# EAGLE design pneu-io (EAGLE 7.6.0)
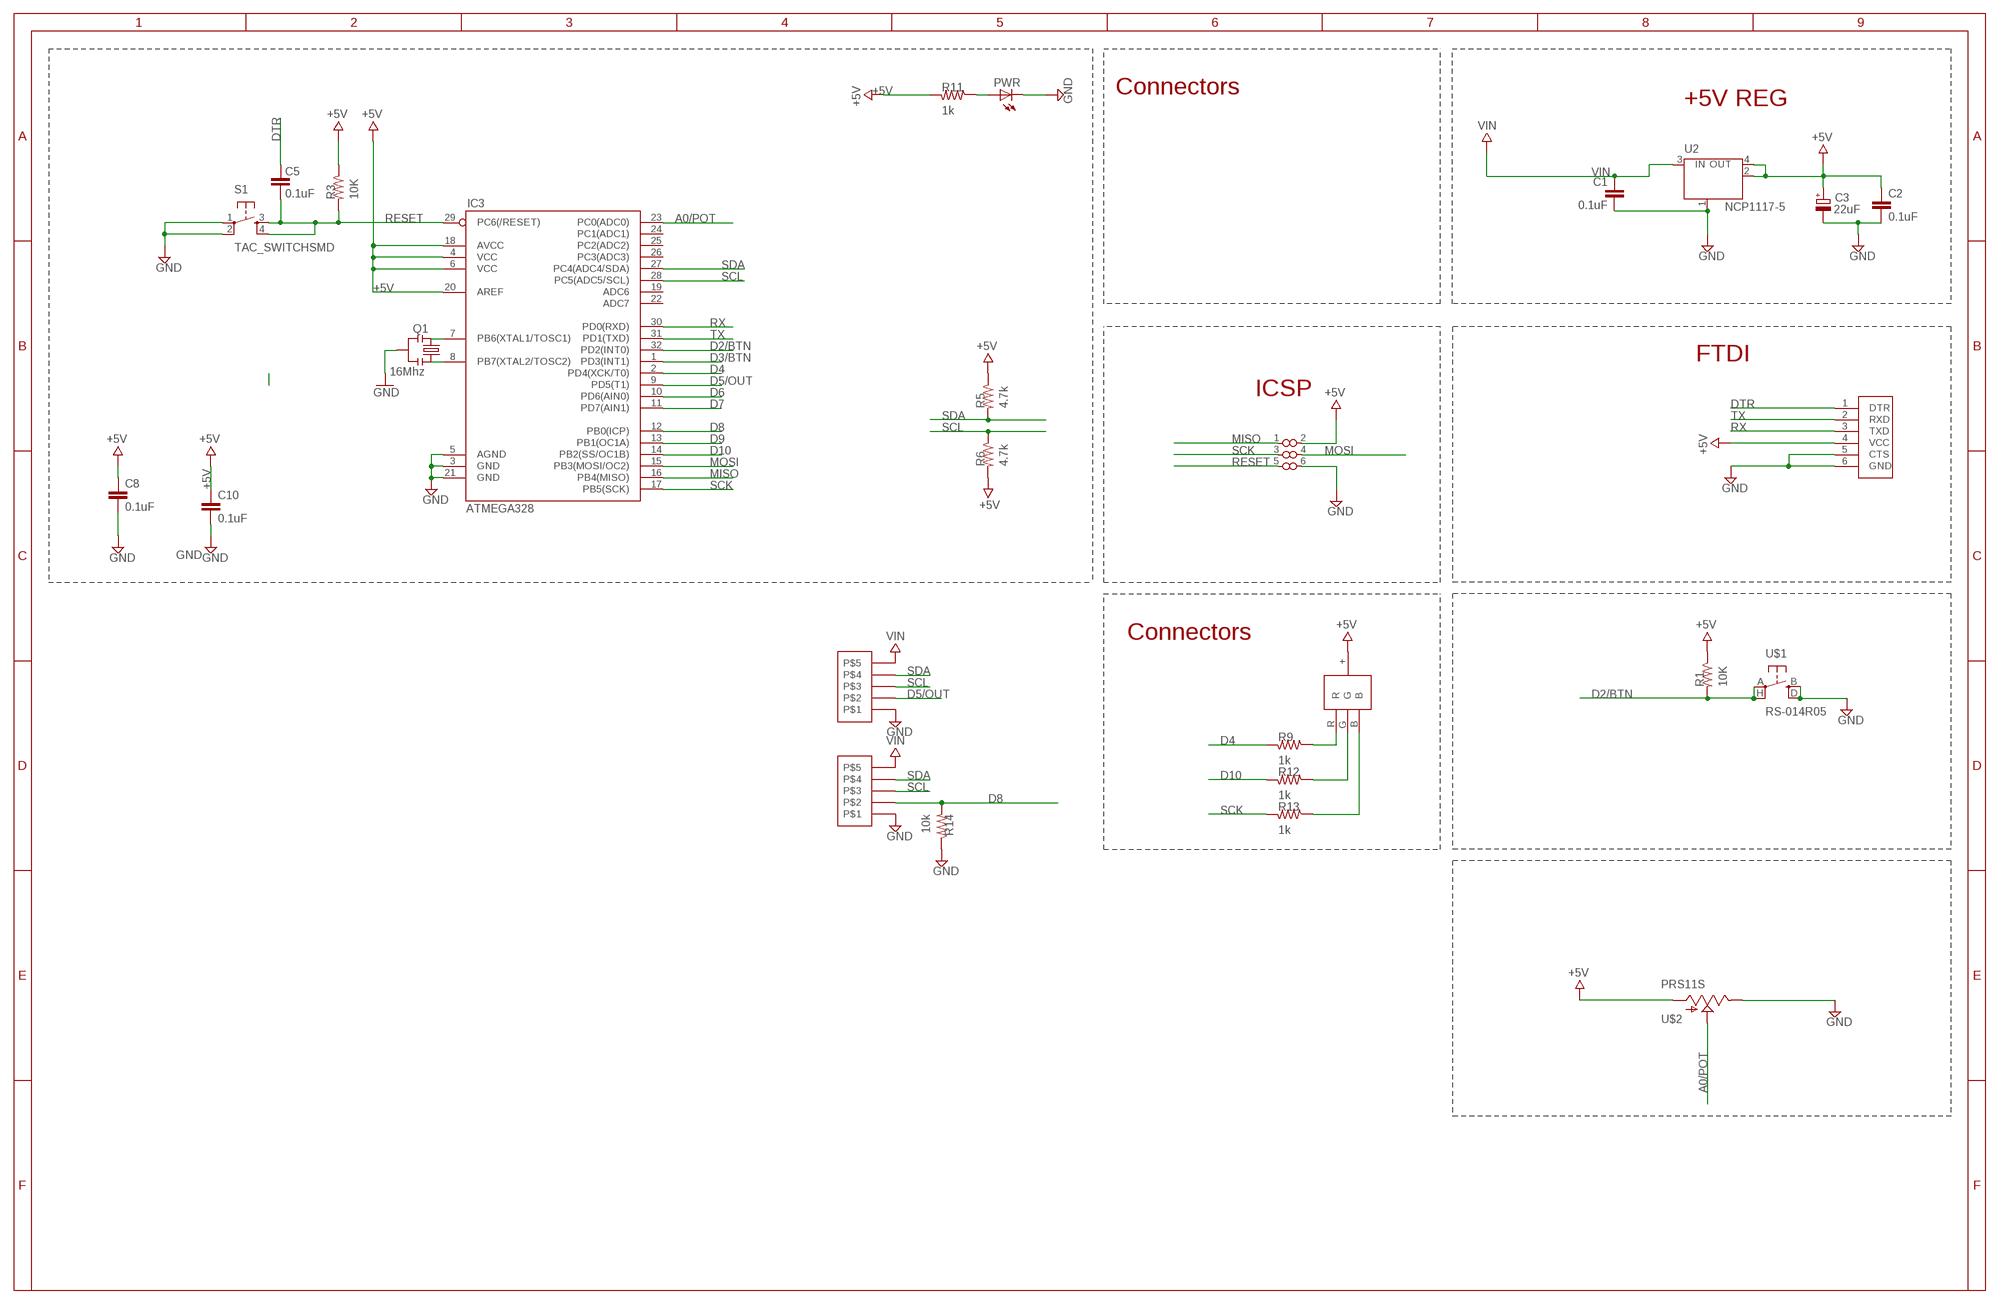
[diagram p0: schematic, sheet 1]

## Parts
C1  0.1uF  CAP0603-CAP  [0603-CAP]
C2  0.1uF  CAP0603-CAP  [0603-CAP]
C3  22uF  CPOL-EUSMCB  [SMC_B]
C5  0.1uF  CAP0603-CAP  [0603-CAP]
C8  0.1uF  CAP0603-CAP  [0603-CAP]
C10  0.1uF  CAP0603-CAP  [0603-CAP]
IC3  ATMEGA328  ATMEGA168  [TQFP32-08]
PWR  LEDCHIPLED_0603  [CHIPLED_0603]
Q1  16Mhz  RESONATORSMD  [RESONATOR-SMD]
R1  10K  RESISTOR0805-RES  [0805]
R3  10K  RESISTOR0805-RES  [0805]
R5  4.7k  RESISTOR0805-RES  [0805]
R6  4.7k  RESISTOR0805-RES  [0805]
R9  1k  RESISTOR0805-RES  [0805]
R11  1k  RESISTOR0805-RES  [0805]
R12  1k  RESISTOR0805-RES  [0805]
R13  1k  RESISTOR0805-RES  [0805]
R14  10k  RESISTOR0805-RES  [0805]
S1  TAC_SWITCHSMD  [TACTILE-SWITCH-SMD]
U2  NCP1117-5  LINEAR_MC33269ST  [LINEAR_SOT223]
U$1  RS-014R05  [SWITCH-11MM]
U$2  PRS11S  [PRS11S]
U$10  ISP_POGO  [POGO_ISP]
U$12  FTDI_POGO  [FTDI_POGO]
U$21  LTST-C19FD1WT  [LTST]
U$24  1X05  [1X05_TIGHT]
U$27  1X05  [1X05_TIGHT]

## Nets
+5V: C2.1 C3.+ C8.1 C10.1 IC3.4(VCC) IC3.6(VCC) IC3.18(AVCC) IC3.20(AREF) R1.1 R3.1 R5.1 R6.2 R11.2 U2.2(OUT) U2.4(OUT) U$2.1(A) U$10.2(VCC) U$12.4(VCC) U$21.+(VCC)
A0/POT: IC3.23(PC0(ADC0)) U$2.2(S)
D2/BTN: IC3.32(PD2(INT0)) R1.2 U$1.A U$1.H
D3/BTN: IC3.1(PD3(INT1))
D4: IC3.2(PD4(XCK/T0)) R9.2
D5/OUT: IC3.9(PD5(T1)) U$27.P$4
D6: IC3.10(PD6(AIN0))
D7: IC3.11(PD7(AIN1))
D8: IC3.12(PB0(ICP)) R14.2 U$24.P$4
D9: IC3.13(PB1(OC1A))
D10: IC3.14(PB2(SS/OC1B)) R12.2
DTR: C5.2 U$12.1(DTR)
GND: C1.2 C2.2 C3.- C8.2 C10.2 IC3.3(GND) IC3.5(AGND) IC3.21(GND) PWR.C Q1.2 R14.1 S1.1 S1.2 U2.1(GND/ADJ) U$1.B U$1.D U$2.3(E) U$10.6(GND) U$12.5(CTS) U$12.6(GND) U$24.P$5 U$27.P$5
MISO: IC3.16(PB4(MISO)) U$10.1(MISO)
MOSI: IC3.15(PB3(MOSI/OC2)) U$10.4(MOSI)
N$4: IC3.8(PB7(XTAL2/TOSC2)) Q1.1
N$8: IC3.7(PB6(XTAL1/TOSC1)) Q1.3
N$10: PWR.A R11.1
N$11: R9.1 U$21.R
N$12: R12.1 U$21.G
N$13: R13.1 U$21.B
RESET: C5.1 IC3.29(PC6(/RESET)) R3.2 S1.3 S1.4 U$10.5(RESET)
RX: IC3.30(PD0(RXD)) U$12.3(TXD)
SCK: IC3.17(PB5(SCK)) R13.2 U$10.3(SCK)
SCL: IC3.28(PC5(ADC5/SCL)) R6.1 U$24.P$3 U$27.P$3
SDA: IC3.27(PC4(ADC4/SDA)) R5.2 U$24.P$2 U$27.P$2
TX: IC3.31(PD1(TXD)) U$12.2(RXD)
VIN: C1.1 U2.3(IN) U$24.P$1 U$27.P$1
Unconnected: IC3.19(ADC6) IC3.22(ADC7) IC3.24(PC1(ADC1)) IC3.25(PC2(ADC2)) IC3.26(PC3(ADC3))

## Notes on the sheet
- Connectors
- +5V REG
- FTDI
- ICSP
- Connectors

## Library data of the parts
C1 C2 C5 C8 C10 = SparkFun-Capacitors:CAP: Capacitor Standard 0603 ceramic capacitor, and 0.1" leaded capacitor.
C3 = rcl:CPOL-EU: POLARIZED CAPACITOR, European symbol
IC3 = SparkFun:ATMEGA168
PWR = adafruit:LED: LED OSRAM: - CHIPLED LG R971, LG N971, LY N971, LG Q971, LY Q971, LO R971, LY R971 LH N974, LH R974 LS Q976, LO Q976, LY Q976 LO Q996 - Hyper CHIPLED LW Q18S LB Q993, LB Q99A, LB R99A - SideLED LS A670, LO A670, LY A670, LG A670, LP A670 LB A673, LV A673, LT A673, LW A673 LH A674 LY A675 LS A676, LA A676, LO A676, LY A676, LW A676 LS A679, LY A679, LG A679 - Hyper Micro SIDELED® LS Y876, LA Y876, LO Y876, LY Y876 LT Y87S - SmartLED LW L88C, LW L88S LB L89C, LB L89S, LG L890 LS L89K, LO L89K, LY L89K LS L896, LA L896, LO L896, LY L896 - TOPLED LS T670, LO T670, LY T670, LG T670, LP T670 LSG T670, LSP T670, LSY T670, LOP T670, LYG T670 LG T671, LOG T671, LSG T671 LB T673, LV T673, LT T673, LW T673 LH T674 LS T676, LA T676, LO T676, LY T676, LB T676, LH T676, LSB T676, LW T676 LB T67C, LV T67C, LT T67C, LS T67K, LO T67K, LY T67K, LW E67C LS E67B, LA E67B, LO E67B, LY E67B, LB E67C, LV E67C, LT E67C LW T67C LS T679, LY T679, LG T679 LS T770, LO T770, LY T770, LG T770, LP T770 LB T773, LV T773, LT T773, LW T773 LH T774 LS E675, LA E675, LY E675, LS T675 LS T776, LA T776, LO T776, LY T776, LB T776 LHGB T686 LT T68C, LB T68C - Hyper Mini TOPLED® LB M676 - Mini TOPLED Santana® LG M470 LS M47K, LO M47K, LY M47K Source: http://www.osram.convergy.de/
Q1 = SparkFun:RESONATOR: Resonator Small SMD resonator. This is the itty bitty 10/20MHz resonators with built in caps. CSTCE10M0G55 and CSTCE20M0V53. Footprint has been reviewed closely but hasn't been tested yet.
R1 R3 R5 R6 R9 R11-R14 = SparkFun-Resistors:RESISTOR: Resistor Basic schematic elements and footprints for 0603, 1206, and PTH resistors.
S1 = SparkFun-Electromechanical:TAC_SWITCH: Momentary Switch Button commonly used for reset or general input. Spark Fun Electronics SKU : COM-00097 SMT- SWCH-08247; PROD_ID: SWCH-08247
U2 = SmartPrj:LINEAR_MC33269ST*: Adjustable Output Low Dropout Voltage Regulator 800 mA Source: http://www.onsemi.com/pub/Collateral/MC33269-D.PDF
U$1 = digikey:RS-014R05
U$2 = digikey:PRS11S
U$10 = digikey:ISP_POGO
U$12 = digikey:FTDI_POGO
U$21 = digikey:LTST-C19FD1WT
U$24 U$27 = digikey:1X05

## Net classes
1 vcc: width 0.254 mm

## Board
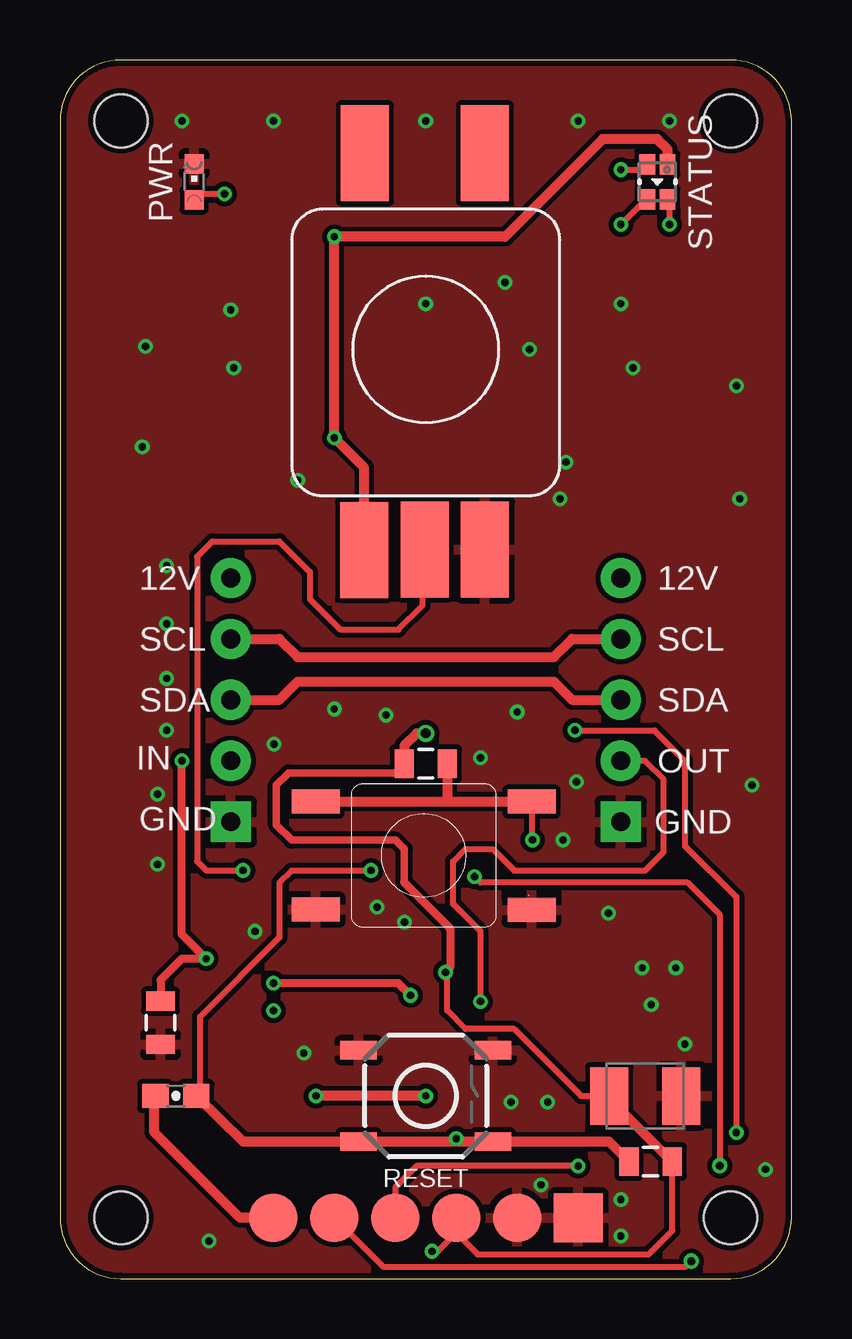
[diagram p1: board, top side]
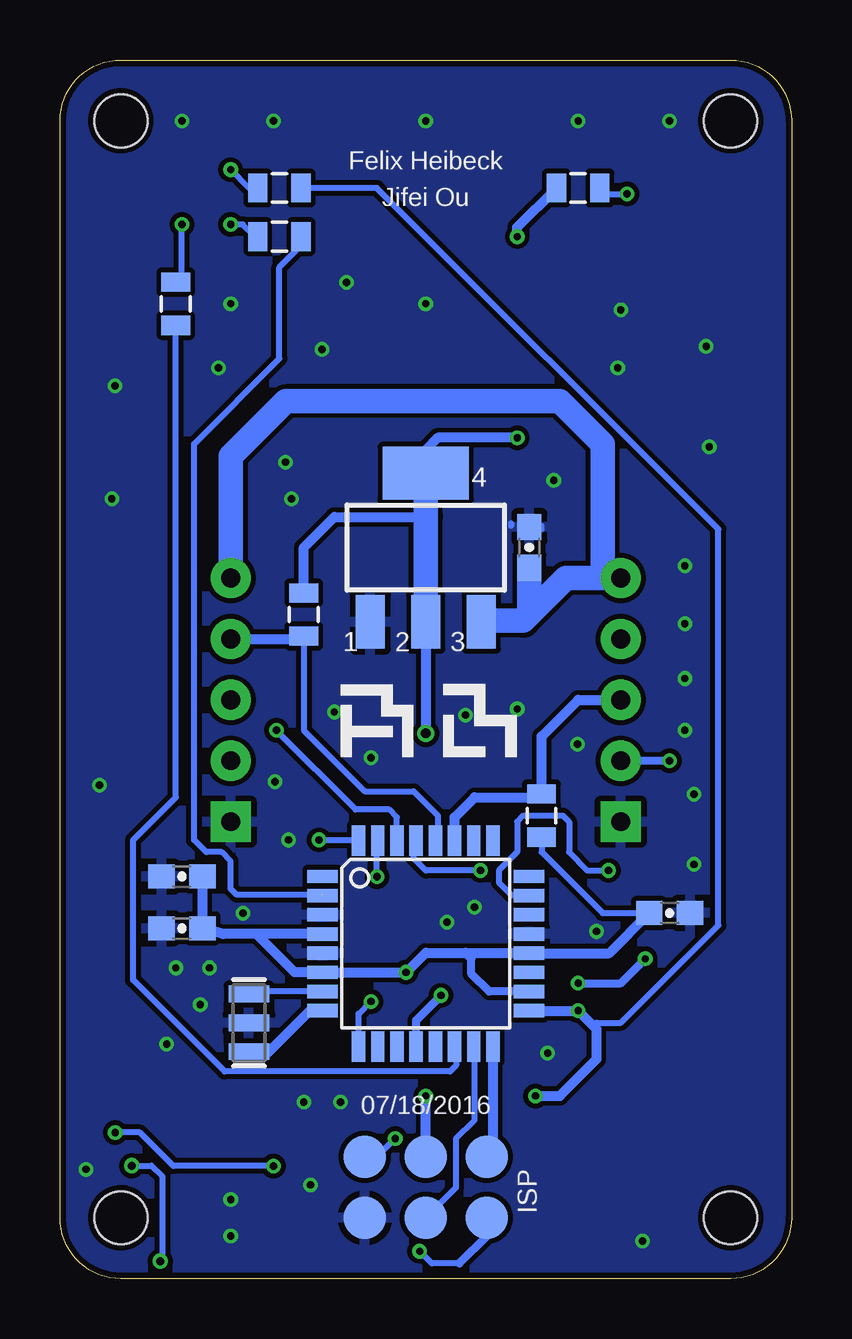
[diagram p2: board, bottom side, seen from below]

Size 30.48 x 50.8 mm. Coordinates in mm from the lower left corner, seen from the top.
Outline: 2.54,0 27.94,0 arc90 30.48,2.54 30.48,48.26 arc90 27.94,50.8 2.54,50.8 arc90 0,48.26 0,2.54 arc90 2.54,0
Copper layers (1*16): Top 0.035mm / dielectric 1.5mm / Bottom 0.035mm
Design rules "autoroute-10mil *": minimum track width 10mil, minimum drill 12mil, track to track 8mil, track to pad 8mil, pad to pad 8mil, via to via 8mil, smd to smd 0mil, copper to edge 10mil, drill to drill 10mil, minimum pad ring 10mil, minimum via ring 6mil, stop-mask expansion 2mil, vias tented up to drill 16mil, thermal gap 10mil
Holes 2.2 mm at 2.54,48.26 27.94,48.26 27.94,2.54 2.54,2.54

### Footprints (pad centres in the part's own frame; a part is rotated, then mirrored left to right if it is on the bottom)
0603-CAP = smd 1.1 x 1: 1 -0.85,0; 2 0.85,0
SMC_B = smd 1.6 x 2.4: + -1.5,0; - 1.5,0
TQFP32-08 = smd 1.27 x 0.559: 1 -4.293,2.8; 2 -4.293,2; 3 -4.293,1.2; 4 -4.293,0.4; 5 -4.293,-0.4; 6 -4.293,-1.2; 7 -4.293,-2; 8 -4.293,-2.8; 17 4.293,-2.8; 18 4.293,-2; 19 4.293,-1.2; 20 4.293,-0.4; 21 4.293,0.4; 22 4.293,1.2; 23 4.293,2; 24 4.293,2.8 | smd 0.559 x 1.27: 9 -2.8,-4.293; 10 -2,-4.293; 11 -1.2,-4.293; 12 -0.4,-4.293; 13 0.4,-4.293; 14 1.2,-4.293; 15 2,-4.293; 16 2.8,-4.293; 25 2.8,4.293; 26 2,4.293; 27 1.2,4.293; 28 0.4,4.293; 29 -0.4,4.293; 30 -1.2,4.293; 31 -2,4.293; 32 -2.8,4.293
CHIPLED_0603 = smd 0.8 x 0.8: A 0,-0.75; C 0,0.75
RESONATOR-SMD = smd 0.7 x 1.7: 1 -1.2,0; 2 0,0; 3 1.2,0
0805 = smd 0.8 x 1.2: 1 -0.9,0; 2 0.9,0
TACTILE-SWITCH-SMD = smd 1.524 x 0.762: 1 -2.794,1.905; 2 2.794,1.905; 3 -2.794,-1.905; 4 2.794,-1.905
LINEAR_SOT223 = smd 1.219 x 2.235: 1 -2.311,-3.099; 2 0,-3.099; 3 2.311,-3.099 | smd 3.6 x 2.2: 4 0,3.099
SWITCH-11MM = smd 2 x 1: A -4.46,2.24; B -4.46,-2.26; D 4.54,-2.27; H 4.54,2.24
PRS11S = smd 2 x 4: 1 -2.565,-8.611; 2 -0.051,-8.585; 3 2.464,-8.585; 4 -2.54,7.925; 5 2.464,7.925
POGO_ISP = smd 1.778 x 1.778: 1 -1.27,2.54; 2 1.27,2.54; 3 -1.27,0; 4 1.27,0; 5 -1.27,-2.54; 6 1.27,-2.54
FTDI_POGO = smd 2.032 x 2.032: 1 -6.35,0; 2 -3.81,0; 3 -1.27,0; 4 1.27,0; 5 3.81,0; 6 6.35,0
LTST = smd 0.65 x 0.85: + 0.425,0.725; B -0.425,0.725; G 0.425,-0.725; R -0.425,-0.725
1X05_TIGHT = drill 0.787 pad 1.676: P$1 5.08,0; P$2 0,0; P$3 2.54,0; P$4 -2.54,0 | drill 0.787 pad 1.676 square: P$5 -5.08,0

### Placement (x,y rotation side)
C1  10.92,30.48 90 bottom
C2  5.08,15.24 0 bottom
C3  24.38,7.62 0 top
C5  4.83,7.62 180 top
C8  25.4,14.61 180 bottom
C10  25.4,16.76 180 bottom
IC3  15.24,13.97 0 bottom
PWR  5.59,45.72 0 top
Q1  22.61,10.67 90 bottom
R1  15.24,21.46 0 top
R3  24.61,4.88 180 top
R5  10.41,19.3 90 bottom
R6  20.32,27.69 90 bottom
R9  21.34,43.43 0 bottom
R11  8.89,45.47 180 bottom
R12  25.65,40.64 270 bottom
R13  21.34,45.47 0 bottom
R14  4.19,10.67 90 top
S1  15.24,7.62 0 top
U2  15.24,30.48 0 bottom
U$1  15.11,17.65 0 top
U$2  15.24,38.99 0 top
U$10  15.24,3.81 270 bottom
U$12  15.24,2.54 0 top
U$21  24.89,45.72 0 top
U$24  7.11,24.13 90 top
U$27  23.37,24.13 90 top

### Tracks (layer width: path | path; a pad name or v marks a point on that pad's centre or on a via)
+5V  (via drill 0.3, 0.41)
  Top 0.254: C3.+ 21.72,7.62 18.92,10.41 16.89,10.41 16.13,11.18 16.13,12.7 v16.06,12.77 | v15.49,1.14 15.75,1.14 16.51,1.91 17.4,1.02 24.52,1.02 25.51,2 R3.1
  Top 0.305: 14.34,16.52 14.35,16.52 14.35,17.91 13.97,18.29 9.65,18.29 9.02,18.92 9.02,20.57 9.53,21.08 13.96,21.08 R1.1
  Top 0.33: 14.34,16.52 16.26,14.61 16.26,12.97 v16.06,12.77 | 16.51,1.91 U$12.4 17.02,2.54
  Top 0.406: C3.+ 22.88,7.19 23.2,7.19 R3.1 | U$2.1 12.68,33.81 v11.43,35.05 v11.43,43.43 18.54,43.43 22.61,47.5 24.89,47.5 25.32,47.07 U$21.+ | v15.24,22.73 14.86,22.73 14.35,22.23 14.35,21.86 R1.1
  Bottom 0.254: R5.1 10.41,17.78 7.87,15.24 C2.1 | 13.84,0.64 14.99,0.64 v15.49,1.14
  Bottom 0.33: IC3.18 12.61,11.97 13.34,12.7 13.34,13.34 13.59,13.59 | U$10.2 12.7,1.78 13.84,0.64
  Bottom 0.406: C10.1 C8.1 23.68,14.37 22.3,14.37 | IC3.4 22.3,14.37 | 22.3,14.37 20.7,12.77 IC3.6 v16.06,12.77 | C2.1 7.6,13.57 IC3.20 10.97,13.59 13.59,13.59 15.24,13.59 v16.06,12.77 | v11.43,35.05 14.73,35.05 15.24,34.54 U2.4 | v11.43,43.43 11.43,43.83 R11.2 | R6.2 20.32,30.48 19.05,31.75 15.24,31.75 | U2.2 v15.24,22.73 | v16.06,12.77
  Bottom 1.016: U2.2 15.24,31.75 U2.4
A0/POT  (via drill 0.3)
  Top 0.254: 14.99,30.73 14.99,32 U$2.2 15.11,30.33 15.11,28.07 14.1,27.05 11.68,27.05 10.41,28.32 10.41,29.46 9.14,30.73 6.35,30.73 5.71,30.1 5.71,17.4 6.1,17.02 v7.62,17.02
  Bottom 0.254: IC3.23 11.18,16 11.68,16 12.19,16.51 12.19,17.02 11.43,17.78 11.43,19.05 11.18,19.3 9.53,19.3 9.27,19.05 9.27,17.78 8.51,17.02 v7.62,17.02
D2/BTN  (via drill 0.3)
  Top 0.254: U$1.H 19.65,18.32 v19.68,18.29
  Top 0.406: U$1.A 16.26,19.89 | 16.26,19.89 U$1.H | R1.2 16.14,20.01 16.26,19.89
  Bottom 0.254: v19.68,18.29 18.07,18.29 IC3.32
D4  (1 unrouted)
  Bottom 0.254: 19.56,16 23.11,16 23.37,16.26 23.37,17.4 23.75,17.78 24.38,17.78 24.89,18.29 24.89,19.81 24.89,34.8 21.34,38.35 21.34,42.16 20.57,42.93 20.57,43.43 R9.2
D5/OUT  (via drill 0.3)
  Top 0.254: v17.53,11.56 17.53,14.48 16.38,15.62 16.38,17.4 16.89,17.91 18.03,17.91 18.92,17.02 24.38,17.02 25.15,17.78 25.15,20.83 24.38,21.59 U$27.P$4
  Bottom 0.254: IC3.9 18.04,11.04 v17.53,11.56
D8  (via drill 0.3)
  Top 0.33: v14.61,11.81 14.1,12.32 v8.89,12.32 | v5.08,21.59 5.08,14.35 v6.1,13.34 5.08,13.34 4.19,12.45 R14.2
  Bottom 0.33: IC3.12 15.64,10.78 v14.61,11.81 | v8.89,12.32 7.11,12.32 v6.1,13.34 | v5.08,21.59 U$24.P$4
D10
  Bottom 0.254: R12.2 25.65,20.07 27.43,18.29 27.43,12.45 23.62,8.64 14.22,8.64 13.97,8.89 13.97,9.65 IC3.14
DTR
  Top 0.406: U$12.1 7.49,2.54 3.94,6.1 3.94,7.61 C5.2
GND  (via drill 0.3)
  Bottom 0.254: U$10.6 18.54,2.54 | 10.41,31.24 10.41,31.38 | 11.68,31.5 11.68,31.38
  other vias: 5.08,48.26 15.24,48.26 21.59,48.26 20.04,3.91 25.4,48.26 23.37,1.78 4.45,29.72 4.06,20.19 4.45,27.3 4.45,25.02 4.45,22.86 23.37,3.3 8.89,48.26 9.91,33.27 20.83,32.51 7.11,40.39 15.24,40.64 23.37,40.64 20.95,18.29 24.64,11.43 20.32,7.37 18.8,7.37 10.16,9.4 4.06,17.27 8.13,14.48 25.65,12.95 26.04,9.78 22.86,15.24 24.26,12.95 14.35,14.86 19.05,23.62 13.59,23.5 21.08,34.04 19.56,38.73 7.24,37.97 11.43,23.75 13.21,15.49 17.53,21.72 23.88,37.97 28.19,37.21 28.32,32.51 3.56,38.86 6.21,1.57 18.54,41.53 28.83,20.57 29.39,4.56 3.43,34.67 21.52,20.71 8.92,22.28
  pour Bottom: 0.25,55.12 30.73,55.37 30.73,-2.79 0.25,-3.05
  pour Top: -1.02,54.36 30.73,54.36 30.73,-2.29 -1.02,-2.29
MISO
  Bottom 0.406: IC3.16 12.44,5.34 U$10.1
MOSI
  Bottom 0.254: U$10.4 13.97,3.81 13.97,5.84 13.21,6.6 13.21,9.65 IC3.15
N$4
  Bottom 0.254: 21.84,9.4 22.54,9.4 Q1.1
  Bottom 0.406: IC3.8 20.07,11.17 21.84,9.4
N$8
  Bottom 0.254: IC3.7 22.5,11.97 Q1.3
N$10  (via drill 0.3)
  Top 0.254: v6.86,45.21 5.59,45.21 PWR.A
  Bottom 0.254: v6.86,45.21 7.62,45.21 7.87,45.47 R11.1
N$11  (via drill 0.3)
  Top 0.254: v23.37,43.94 24.38,44.96 U$21.R
  Bottom 0.254: v23.37,43.94 22.86,43.94 22.35,43.43 R9.1
N$12  (via drill 0.3)
  Top 0.254: v25.4,43.94 25.4,44.96 U$21.G
  Bottom 0.254: v25.4,43.94 25.4,41.91 25.65,41.66 R12.1
N$13  (via drill 0.3)
  Top 0.254: v23.37,46.23 24.38,46.23 U$21.B
  Bottom 0.254: v23.37,46.23 22.61,45.47 R13.1
RESET  (via drill 0.3)
  Top 0.254: v12.95,17.02 9.65,17.02 9.14,16.51 9.14,14.22 5.84,10.92 5.84,7.62 C5.1 | v16.51,5.84 16.51,5.71
  Top 0.406: C5.1 7.63,5.71 S1.3 16.51,5.71 S1.4 22.88,5.71 R3.2
  Bottom 0.254: v12.95,17.02 15.24,17.02 15.75,17.53 15.75,18.03 IC3.29 | U$10.5 17.27,5.08 v16.51,5.84
RX  (via drill 0.3)
  Top 0.254: v21.46,22.86 24.77,22.86 26.04,21.59 26.04,18.03 28.18,15.92 v28.18,6.1 | v21.59,4.7 14.86,4.7 13.97,3.81 U$12.3
  Bottom 0.254: IC3.30 16.44,19.23 16.76,19.56 18.16,19.56 v21.46,22.86 | v21.59,4.7 25.75,4.7 27.15,6.09 28.07,6.09 v28.18,6.1
SCK  (via drill 0.3)
  Top 0.406: v15.24,7.62 v10.67,7.62
  Bottom 0.254: R13.2 17.27,45.47 3.05,31.24 3.05,14.73 7.11,10.67 8.13,10.67 8.25,10.54
  Bottom 0.406: U$10.3 v15.24,7.62 | v10.67,7.62 9.65,7.62 8.13,9.14 8.13,10.41 8.25,10.54 v8.88,11.17 IC3.17 v8.9,11.17 v8.89,11.18
SCL
  Top 0.406: U$24.P$3 9.14,26.67 9.91,25.91 20.57,25.91 21.34,26.67 U$27.P$3
  Bottom 0.254: R6.1 20.32,22.86 17.78,20.32 15.75,20.32 14.73,19.3 14.73,18.29 IC3.28
  Bottom 0.406: U$27.P$3 20.44,26.67 R6.1
SDA
  Top 0.406: U$24.P$2 9.14,24.13 9.91,24.89 20.57,24.89 21.34,24.13 U$27.P$2
  Bottom 0.406: IC3.27 14.04,19.23 13.21,20.07 10.55,20.07 R5.2 10.41,22.61 8.89,24.13 U$24.P$2
TX  (via drill 0.3, 0.33)
  Top 0.254: U$12.2 13.46,0.51 26.08,0.51 v26.3,0.73 | v17.27,16.76 17.53,16.51 26.16,16.51 27.18,15.49 27.49,15.18 v27.49,4.71
  Bottom 0.254: v17.27,16.76 17.27,18.03 IC3.31 | v27.49,4.71 26.67,4.71 26.22,4.26 26.22,0.82 v26.3,0.73
VIN
  Bottom 0.406: U2.3 12.95,27.38 12.95,27.18
  Bottom 1.016: U$24.P$1 7.87,29.21 | 7.87,29.21 9.4,29.21 10.8,27.81 | 10.8,27.81 11.18,27.43 12.88,27.43 U2.3 | C1.1 10.92,27.94 10.8,27.81 | 7.87,29.21 7.87,34.8 9.65,36.58 21.08,36.58 23.37,34.29 U$27.P$1

### Text on the board
tPlace: STATUS
tNames: 12V | 12V | SCL | SCL | SDA | SDA | IN | OUT | GND | GND | RESET
bNames: Felix Heibeck | Jifei Ou | 07/18/2016